# Altium schematic sheet Temp Sensor Interface.SchDoc
size A
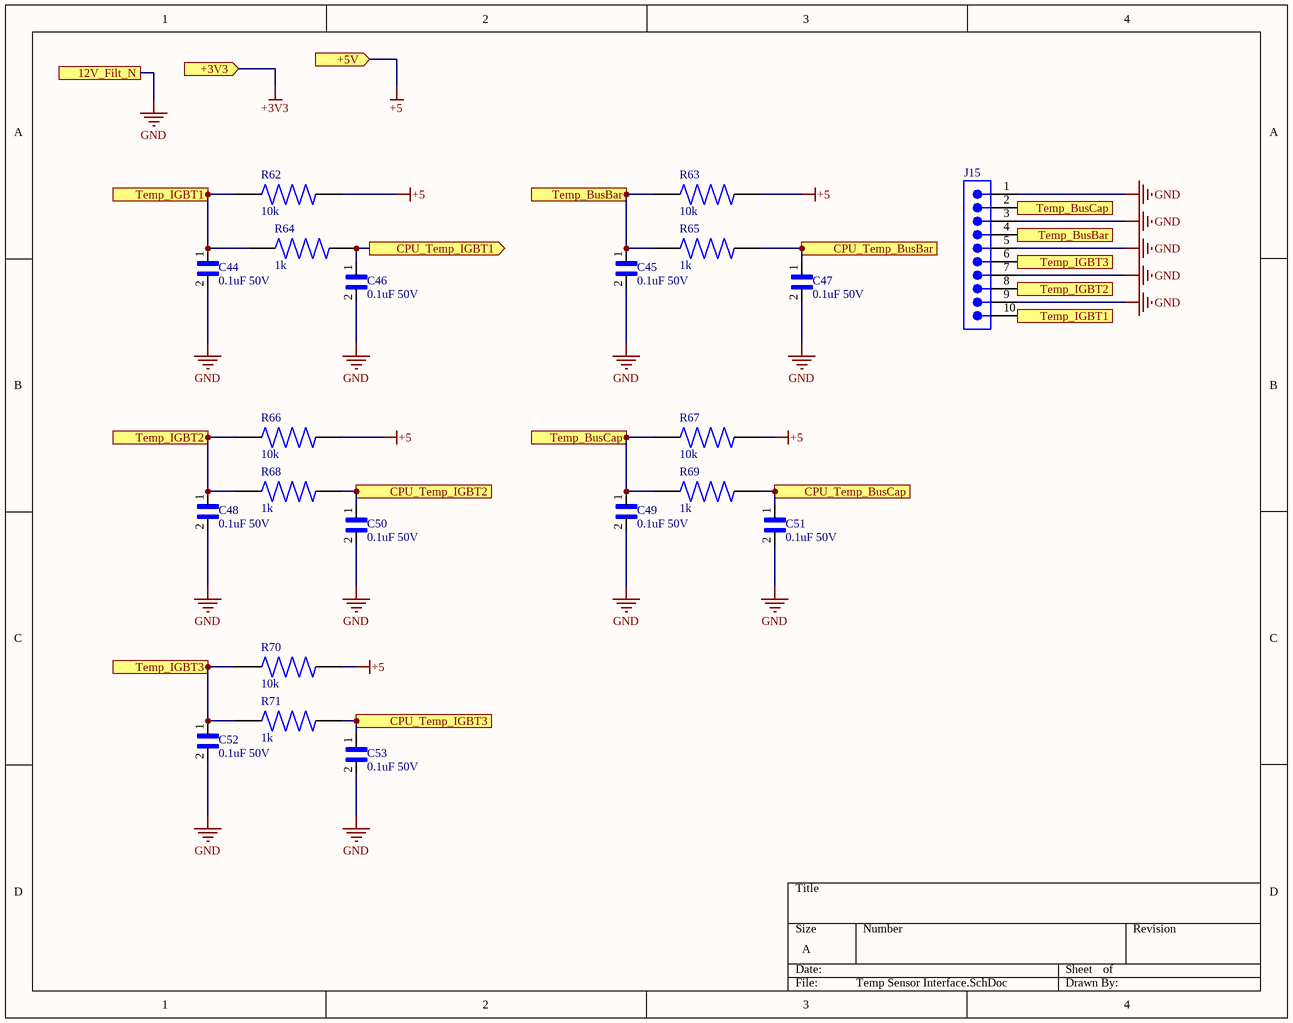
[diagram p0: Temp Sensor Interface.SchDoc]

## Parts
C44  0.1uF 50V  [CAP 0805(2012 metric)]
C45  0.1uF 50V  [CAP 0805(2012 metric)]
C46  0.1uF 50V  [CAP 0805(2012 metric)]
C47  0.1uF 50V  [CAP 0805(2012 metric)]
C48  0.1uF 50V  [CAP 0805(2012 metric)]
C49  0.1uF 50V  [CAP 0805(2012 metric)]
C50  0.1uF 50V  [CAP 0805(2012 metric)]
C51  0.1uF 50V  [CAP 0805(2012 metric)]
C52  0.1uF 50V  [CAP 0805(2012 metric)]
C53  0.1uF 50V  [CAP 0805(2012 metric)]
J15  FH2543-10GT10  [PCBComponent_1]  (value not drawn)
R62  10k  [RES 0805(2012 metric)]
R63  10k  [RES 0805(2012 metric)]
R64  1k  [RES 0805(2012 metric)]
R65  1k  [RES 0805(2012 metric)]
R66  10k  [RES 0805(2012 metric)]
R67  10k  [RES 0805(2012 metric)]
R68  1k  [RES 0805(2012 metric)]
R69  1k  [RES 0805(2012 metric)]
R70  10k  [RES 0805(2012 metric)]
R71  1k  [RES 0805(2012 metric)]

## Ports
12V_Filt_N, +3V3 (in), +5V (in), CPU_Temp_BusBar (out), CPU_Temp_BusCap (out), CPU_Temp_IGBT1 (out), CPU_Temp_IGBT2 (out), CPU_Temp_IGBT3 (out), Temp_BusBar (in), Temp_BusBar (out), Temp_BusCap (in), Temp_BusCap (out), Temp_IGBT1 (in), Temp_IGBT1 (out), Temp_IGBT2 (in), Temp_IGBT2 (out), Temp_IGBT3 (in), Temp_IGBT3 (out)

## Nets
+3V3: port +3V3
+5: R62.2 R63.2 R66.2 R67.2 R70.2 ; port +5V
GND: C44.2 C45.2 C46.2 C47.2 C48.2 C49.2 C50.2 C51.2 C52.2 C53.2 J15.1 J15.3 J15.5 J15.7 J15.9 ; port 12V_Filt_N
CPU_Temp_BusBar: C47.1 R65.2 ; port CPU_Temp_BusBar
CPU_Temp_BusCap: C51.1 R69.2 ; port CPU_Temp_BusCap
CPU_Temp_IGBT1: C46.1 R64.2 ; port CPU_Temp_IGBT1
CPU_Temp_IGBT2: C50.1 R68.2 ; port CPU_Temp_IGBT2
CPU_Temp_IGBT3: C53.1 R71.2 ; port CPU_Temp_IGBT3
Temp_BusBar: C45.1 J15.4 R63.1 R65.1 ; port Temp_BusBar
Temp_BusCap: C49.1 J15.2 R67.1 R69.1 ; port Temp_BusCap
Temp_IGBT1: C44.1 J15.10 R62.1 R64.1 ; port Temp_IGBT1
Temp_IGBT2: C48.1 J15.8 R66.1 R68.1 ; port Temp_IGBT2
Temp_IGBT3: C52.1 J15.6 R70.1 R71.1 ; port Temp_IGBT3

## Library data of the parts
C44-C53 = 0.1uF 50V: 0.1uF 50VDC 0805
J15 = 1009002200006: Connector,Pin Socket,Straight,Female,1x10Pin,2.54MM pitch,8.5,3.2,Gold Flash 1u,black,DIP; Manufacturer: MTCONN; Value: 2.54mm 1x10; Embest PN: 1009002200006; Part Type: Pin Socket; Manufacturer Part Number: FH2543-10GT10
R62 R63 R66 R67 R70 = 10k 0.1W 0805
R64 R65 R68 R69 R71 = 1k: Resistor 0805 1k ohm 0.1W